# EAGLE schematic apex-alpha (EAGLE 5.11)
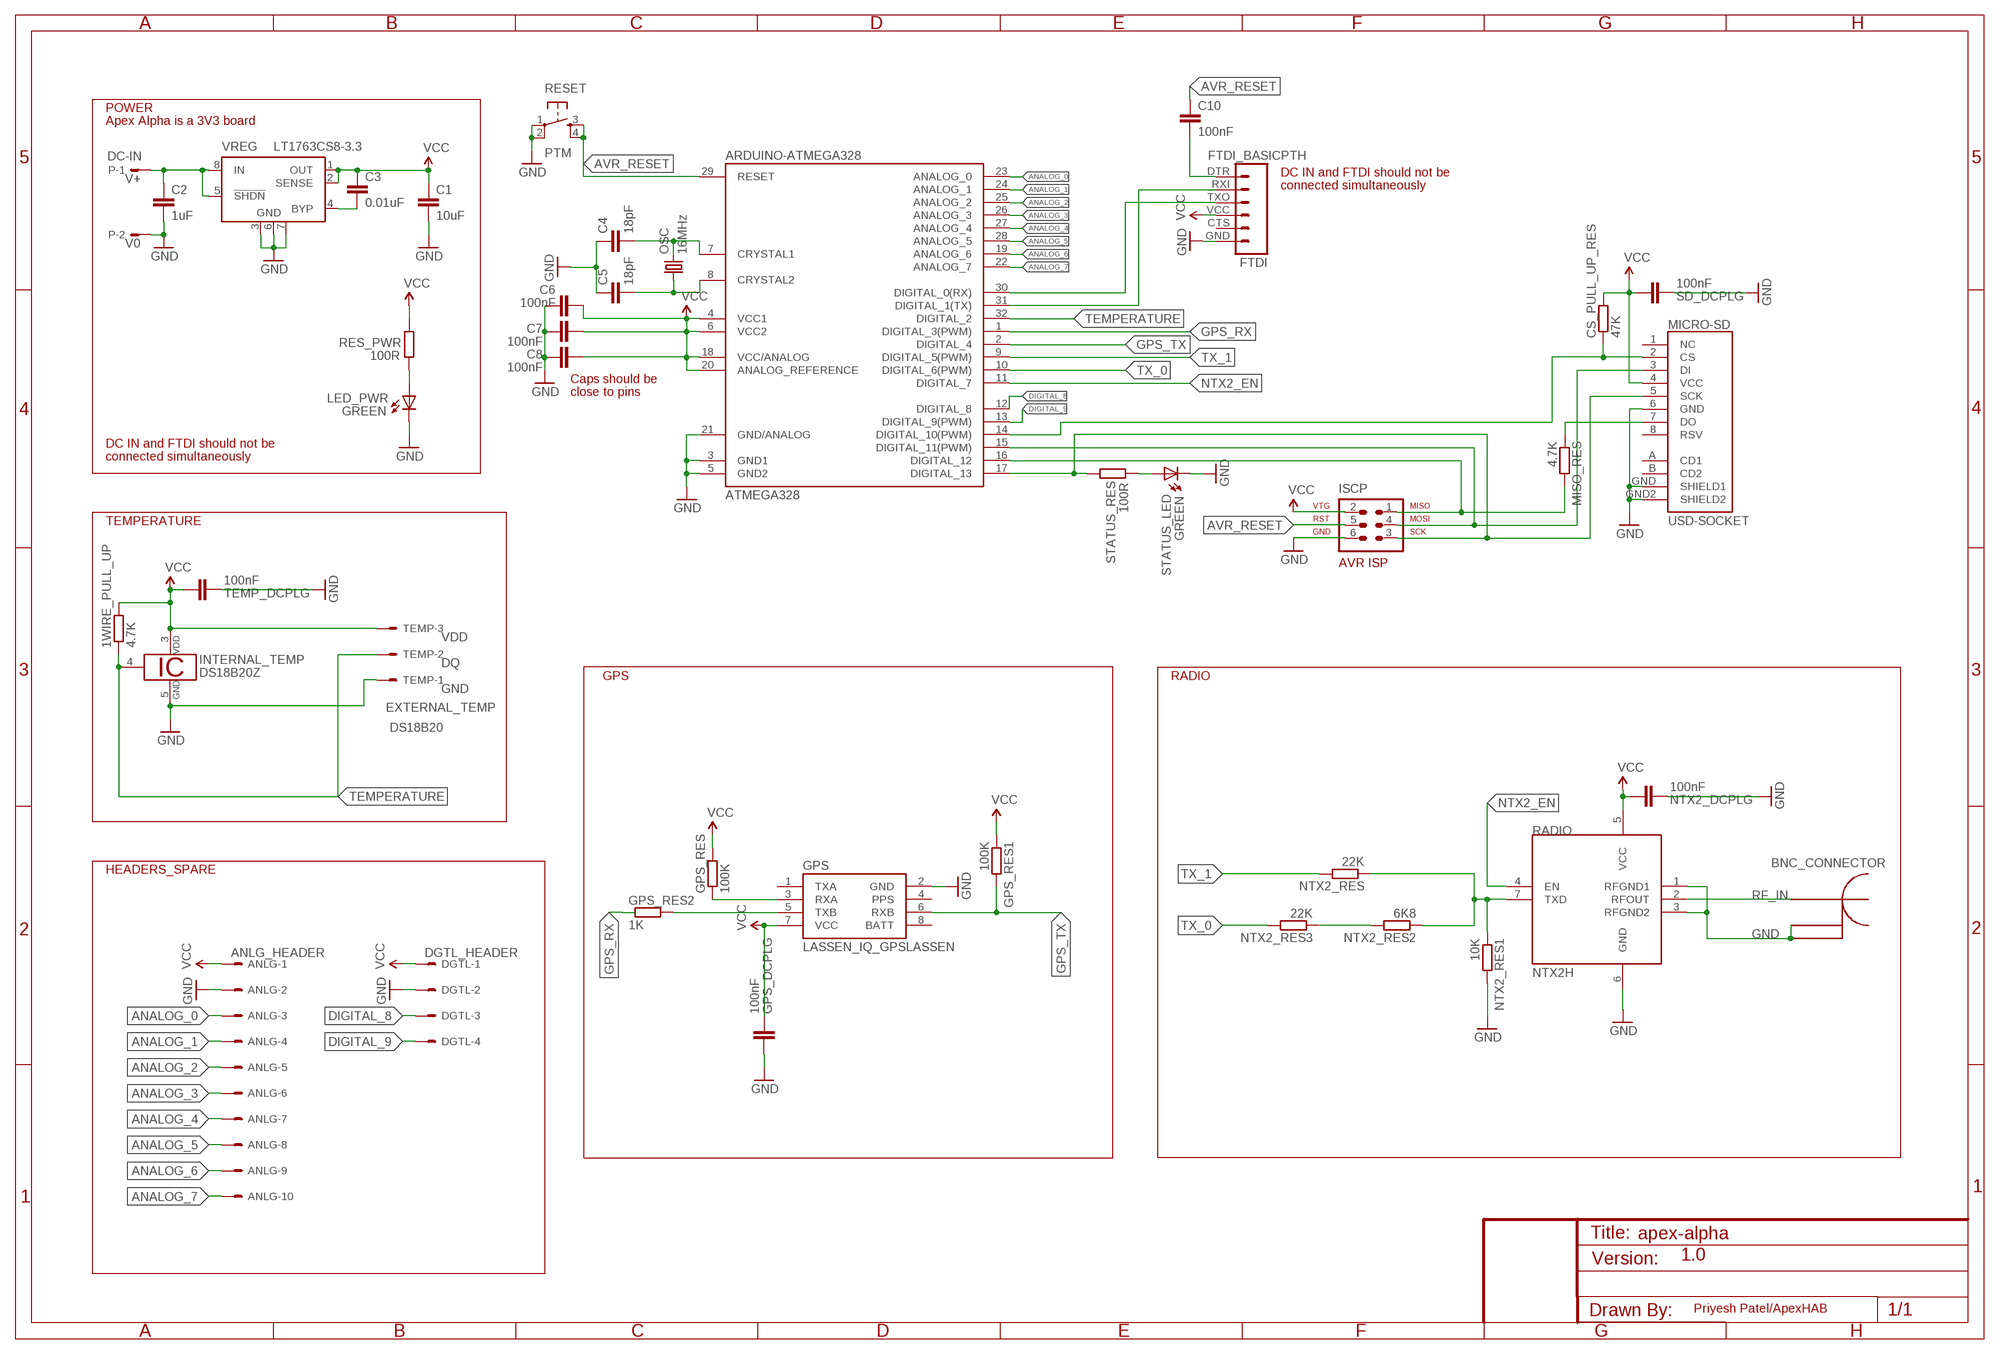
[diagram p0: schematic, sheet 1]

## Parts
1WIRE_PULL_UP  4.7K  R-EU_R0603  [R0603]
ANLG  ANLG_HEADER  22-27-2101-10  [6410-10]
ARDUINO-ATMEGA328  ATMEGA328  ATMEGA168-AU  [TQFP32-08]
C1  10uF  CAP0805  [0805]
C2  1uF  CAP0805  [0805]
C3  0.01uF  CAP0805  [0805]
C4  18pF  CAP0805  [0805]
C5  18pF  CAP0805  [0805]
C6  100nF  CAP0805  [0805]
C7  100nF  CAP0805  [0805]
C8  100nF  CAP0805  [0805]
C10  100nF  CAP0805  [0805]
CS_PULL_UP_RES  47K  R-EU_R0603  [R0603]
DGTL  DGTL_HEADER  22-27-2041-04  [6410-04]
FTDI  FTDI_BASICPTH  [FTDI_BASIC]
GPS  LASSEN_IQ_GPSLASSEN  [LASSEN_IQ_GPS]
GPS_DCPLG  100nF  CAP0805  [0805]
GPS_RES  100K  R-EU_R0603  [R0603]
GPS_RES1  100K  R-EU_R0603  [R0603]
GPS_RES2  1K  R-EU_R0603  [R0603]
INTERNAL_TEMP  DS18B20Z  [SO08]
ISCP  AVR-ISP-6  [AVR-ISP-6]
LED_PWR  GREEN  LEDCHIPLED_0603  [CHIPLED_0603]
MICRO-SD  USD-SOCKET  [MICRO-SD-PUSH-PULL]
MISO_RES  4.7K  R-EU_R0603  [R0603]
NTX2_DCPLG  100nF  CAP0805  [0805]
NTX2_RES  22K  R-EU_R0603  [R0603]
NTX2_RES1  10K  R-EU_R0603  [R0603]
NTX2_RES2  6K8  R-EU_R0603  [R0603]
NTX2_RES3  22K  R-EU_R0603  [R0603]
OSC  16MHz  CRYSTAL5X3  [CRYSTAL-SMD-5X3]
P  DC-IN  22-27-2021-02  [6410-02]
RADIO  NTX2H  [NTX2H]
RES_PWR  100R  R-EU_R0603  [R0603]
RESET  PTM  TAC_SWITCHSMD  [TACTILE_SWITCH_SMD]
SD_DCPLG  100nF  CAP0805  [0805]
STATUS_LED  GREEN  LEDCHIPLED_0603  [CHIPLED_0603]
STATUS_RES  100R  R-EU_R0603  [R0603]
TEMP  EXTERNAL_TEMP  22-27-2031-03  [6410-03]
TEMP_DCPLG  100nF  CAP0805  [0805]
U$1  BNC_BULK  [BNC_BULK]
VREG  LT1763CS8-3.3  [SOIC8]

## Nets
ANALOG_0: ANLG.3 ARDUINO-ATMEGA328.23(ANALOG_0)
ANALOG_1: ANLG.4 ARDUINO-ATMEGA328.24(ANALOG_1)
ANALOG_2: ANLG.5 ARDUINO-ATMEGA328.25(ANALOG_2)
ANALOG_3: ANLG.6 ARDUINO-ATMEGA328.26(ANALOG_3)
ANALOG_4: ANLG.7 ARDUINO-ATMEGA328.27(ANALOG_4)
ANALOG_5: ANLG.8 ARDUINO-ATMEGA328.28(ANALOG_5)
ANALOG_6: ANLG.9 ARDUINO-ATMEGA328.19(ANALOG_6)
ANALOG_7: ANLG.10 ARDUINO-ATMEGA328.22(ANALOG_7)
AVR_RESET: ARDUINO-ATMEGA328.29(RESET) C10.1 ISCP.5 RESET.3 RESET.4
DIGITAL_8: ARDUINO-ATMEGA328.12(DIGITAL_8) DGTL.3
DIGITAL_9: ARDUINO-ATMEGA328.13(DIGITAL_9(PWM)) DGTL.4
GND: ANLG.2 ARDUINO-ATMEGA328.3(GND1) ARDUINO-ATMEGA328.5(GND2) ARDUINO-ATMEGA328.21(GND/ANALOG) C1.2 C2.2 C4.1 C5.1 C6.1 C7.1 C8.1 DGTL.2 FTDI.GND GPS.2(GND) GPS_DCPLG.2 INTERNAL_TEMP.5 ISCP.6 LED_PWR.C MICRO-SD.6(GND) MICRO-SD.GND2(SHIELD2) MICRO-SD.GND(SHIELD1) NTX2_DCPLG.1 NTX2_RES1.2 P.2 RADIO.1(RFGND1) RADIO.3(RFGND2) RADIO.6(GND) RESET.1 RESET.2 SD_DCPLG.1 STATUS_LED.C TEMP.1 TEMP_DCPLG.1 U$1.G1(GND1) U$1.G2(GND) VREG.3(GND) VREG.6(GND) VREG.7(GND)
GPS_RX: ARDUINO-ATMEGA328.1(DIGITAL_3(PWM)) GPS_RES2.1
GPS_TX: ARDUINO-ATMEGA328.2(DIGITAL_4) GPS.6(RXB) GPS_RES1.2
MISO: ARDUINO-ATMEGA328.16(DIGITAL_12) ISCP.1 MISO_RES.2
MOSI: ARDUINO-ATMEGA328.15(DIGITAL_11(PWM)) ISCP.4 MICRO-SD.3(DI)
N$1: C3.2 VREG.4(BYP)
N$2: MICRO-SD.7(DO) MISO_RES.1
N$3: LED_PWR.A RES_PWR.1
N$4: C10.2 FTDI.DTR
N$5: ARDUINO-ATMEGA328.8(CRYSTAL2) C5.2 OSC.1
N$6: ARDUINO-ATMEGA328.7(CRYSTAL1) C4.2 OSC.3
N$7: NTX2_RES2.2 NTX2_RES3.1
N$8: STATUS_LED.A STATUS_RES.1
N$9: ARDUINO-ATMEGA328.31(DIGITAL_1(TX)) FTDI.RXI
N$10: ARDUINO-ATMEGA328.30(DIGITAL_0(RX)) FTDI.TXO
N$11: ARDUINO-ATMEGA328.14(DIGITAL_10(PWM)) CS_PULL_UP_RES.1 MICRO-SD.2(CS)
N$12: NTX2_RES1.1 NTX2_RES2.1 NTX2_RES.1 RADIO.7(TXD)
N$13: GPS.3(RXA) GPS_RES.1
N$14: GPS.5(TXB) GPS_RES2.2
NTX2_EN: ARDUINO-ATMEGA328.11(DIGITAL_7) RADIO.4(EN)
RF_IN: RADIO.2(RFOUT) U$1.RF
SCK: ARDUINO-ATMEGA328.17(DIGITAL_13) ISCP.3 MICRO-SD.5(SCK) STATUS_RES.2
TEMPERATURE: 1WIRE_PULL_UP.1 ARDUINO-ATMEGA328.32(DIGITAL_2) INTERNAL_TEMP.4 TEMP.2
TX_0: ARDUINO-ATMEGA328.10(DIGITAL_6(PWM)) NTX2_RES3.2
TX_1: ARDUINO-ATMEGA328.9(DIGITAL_5(PWM)) NTX2_RES.2
VBATT: C2.1 P.1 VREG.5(!SHDN) VREG.8(IN)
VCC: 1WIRE_PULL_UP.2 ANLG.1 ARDUINO-ATMEGA328.4(VCC1) ARDUINO-ATMEGA328.6(VCC2) ARDUINO-ATMEGA328.18(VCC/ANALOG) ARDUINO-ATMEGA328.20(ANALOG_REFERENCE) C1.1 C3.1 C6.2 C7.2 C8.2 CS_PULL_UP_RES.2 DGTL.1 FTDI.VCC GPS.7(VCC) GPS_DCPLG.1 GPS_RES1.1 GPS_RES.2 INTERNAL_TEMP.3 ISCP.2 MICRO-SD.4(VCC) NTX2_DCPLG.2 RADIO.5(VCC) RES_PWR.2 SD_DCPLG.2 TEMP.3 TEMP_DCPLG.2 VREG.1(OUT) VREG.2(SENSE)
Unconnected: FTDI.CTS GPS.1(TXA) GPS.4(PPS) MICRO-SD.1(NC) MICRO-SD.8(RSV) MICRO-SD.A(CD1) MICRO-SD.B(CD2)

## Notes on the sheet
- POWER
- Apex Alpha is a 3V3 board
- DC IN and FTDI should not be
- V+
- connected simultaneously
- V0
- Caps should be
- close to pins
- DC IN and FTDI should not be
- connected simultaneously
- TEMPERATURE
- VDD
- DQ
- GPS | RADIO
- GND
- DS18B20
- BNC_CONNECTOR
- HEADERS_SPARE
- 1.0
- Priyesh Patel/ApexHAB

## Power pins joined to a net without a drawn wire
BATT: GPS.8(BATT)

## Library data of the parts
1WIRE_PULL_UP CS_PULL_UP_RES GPS_RES GPS_RES1 GPS_RES2 MISO_RES NTX2_RES NTX2_RES1-NTX2_RES3 RES_PWR STATUS_RES = rcl:R-EU_: RESISTOR, European symbol
ANLG = con-molex:22-?-10: CONNECTOR wire to board 2.54 mm (.1 inch) pitch header; OC_FARNELL: unknown; OC_NEWARK: unknown
ARDUINO-ATMEGA328 = Arduino-AVR:ATMEGA168
C1-C8 C10 GPS_DCPLG NTX2_DCPLG SD_DCPLG TEMP_DCPLG = SparkFun:CAP: Capacitor Standard 0603 ceramic capacitor, and 0.1" leaded capacitor.
DGTL = con-molex:22-?-04: CONNECTOR wire to board 2.54 mm (.1 inch) pitch header; OC_FARNELL: unknown; OC_NEWARK: unknown
FTDI = SparkFun:FTDI_BASIC: FTDI Basic: 3.3V and 5V
GPS = SparkFun:LASSEN_IQ_GPS: Lassen iq 12-Channel GPS receiver. Schematic and footprint production proven. Spark Fun Electronics SKU : GPS-00163. Surface mount mating connector : GPS-00170
INTERNAL_TEMP = 1wire:DS18B20: Programmable Resolution Digital Thermometer This chip provides a onewire thermosensor with approx. 0.5°C accuracy. A programmable over/undertemperure alarm is available. The precision can be set from 9..12 bits. Notes: Vdd must be applied for accurate measurements at low temperatures, as the parasite power circuit otherwise heats the sensor. If parasite power is used, Vdd has to be connected to GND. The DS1822 is a low-cost thermometer chip, the DS18S20 is similar to the DS18B20, but with 9 Bit precision only. Author: Jan Kandziora <jjj@gmx.de>
ISCP = avr-4:AVR-ISP-6: AVR ISP-6 Serial Programming Header
LED_PWR STATUS_LED = led:LED: LED OSRAM: - CHIPLED LG R971, LG N971, LY N971, LG Q971, LY Q971, LO R971, LY R971 LH N974, LH R974 LS Q976, LO Q976, LY Q976 LO Q996 - Hyper CHIPLED LW Q18S LB Q993, LB Q99A, LB R99A - SideLED LS A670, LO A670, LY A670, LG A670, LP A670 LB A673, LV A673, LT A673, LW A673 LH A674 LY A675 LS A676, LA A676, LO A676, LY A676, LW A676 LS A679, LY A679, LG A679 - Hyper Micro SIDELED® LS Y876, LA Y876, LO Y876, LY Y876 LT Y87S - SmartLED LW L88C, LW L88S LB L89C, LB L89S, LG L890 LS L89K, LO L89K, LY L89K LS L896, LA L896, LO L896, LY L896 - TOPLED LS T670, LO T670, LY T670, LG T670, LP T670 LSG T670, LSP T670, LSY T670, LOP T670, LYG T670 LG T671, LOG T671, LSG T671 LB T673, LV T673, LT T673, LW T673 LH T674 LS T676, LA T676, LO T676, LY T676, LB T676, LH T676, LSB T676, LW T676 LB T67C, LV T67C, LT T67C, LS T67K, LO T67K, LY T67K, LW E67C LS E67B, LA E67B, LO E67B, LY E67B, LB E67C, LV E67C, LT E67C LW T67C LS T679, LY T679, LG T679 LS T770, LO T770, LY T770, LG T770, LP T770 LB T773, LV T773, LT T773, LW T773 LH T774 LS E675, LA E675, LY E675, LS T675 LS T776, LA T776, LO T776, LY T776, LB T776 LHGB T686 LT T68C, LB T68C - Hyper Mini TOPLED® LB M676 - Mini TOPLED Santana® LG M470 LS M47K, LO M47K, LY M47K Source: http://www.osram.convergy.de LUXEON: - LUMILED® LXK2-PW12-R00, LXK2-PW12-S00, LXK2-PW14-U00, LXK2-PW14-V00 LXK2-PM12-R00, LXK2-PM12-S00, LXK2-PM14-U00 LXK2-PE12-Q00, LXK2-PE12-R00, LXK2-PE12-S00, LXK2-PE14-T00, LXK2-PE14-U00 LXK2-PB12-K00, LXK2-PB12-L00, LXK2-PB12-M00, LXK2-PB14-N00, LXK2-PB14-P00, LXK2-PB14-Q00 LXK2-PR12-L00, LXK2-PR12-M00, LXK2-PR14-Q00, LXK2-PR14-R00 LXK2-PD12-Q00, LXK2-PD12-R00, LXK2-PD12-S00 LXK2-PH12-R00, LXK2-PH12-S00 LXK2-PL12-P00, LXK2-PL12-Q00, LXK2-PL12-R00 Source: www.luxeon.com KINGBRIGHT: KA-3528ASYC Source: www.kingbright.com
MICRO-SD = matt_brejza:USD-SOCKET: microSD Socket Push-push type uSD socket. Schematic element and footprint production proven. Spark Fun Electronics SKU : PRT-00127. tDoc lines correctly indicate media card edge positions when inserting (unlocked, locked, depressed).
OSC = SparkFun:CRYSTAL: Crystals Various standard crystals. Proven footprints. Spark Fun Electronics SKU : COM-00534
P = con-molex:22-?-02: CONNECTOR wire to board 2.54 mm (.1 inch) pitch header; OC_FARNELL: unknown; OC_NEWARK: unknown
RADIO = matt_brejza:NTX2
RESET = SparkFun:TAC_SWITCH: Momentary Switch Button commonly used for reset or general input. Spark Fun Electronics SKU : COM-00097
TEMP = con-molex:22-?-03: CONNECTOR wire to board 2.54 mm (.1 inch) pitch header; OC_FARNELL: unknown; OC_NEWARK: unknown
U$1 = matt_brejza:BNC_BULK
VREG = linear-technology:LT1763CS8: 500mA, Low Noise, LDO Micropower Regulators Source: http://cds.linear.com/docs/Datasheet/1763ff.pdf; MPN: LT1763CS8-3.3; OC_FARNELL: 1273617; OC_NEWARK: 57M6055